# Altium schematic sheet PassiveFilter.SchDoc
size A
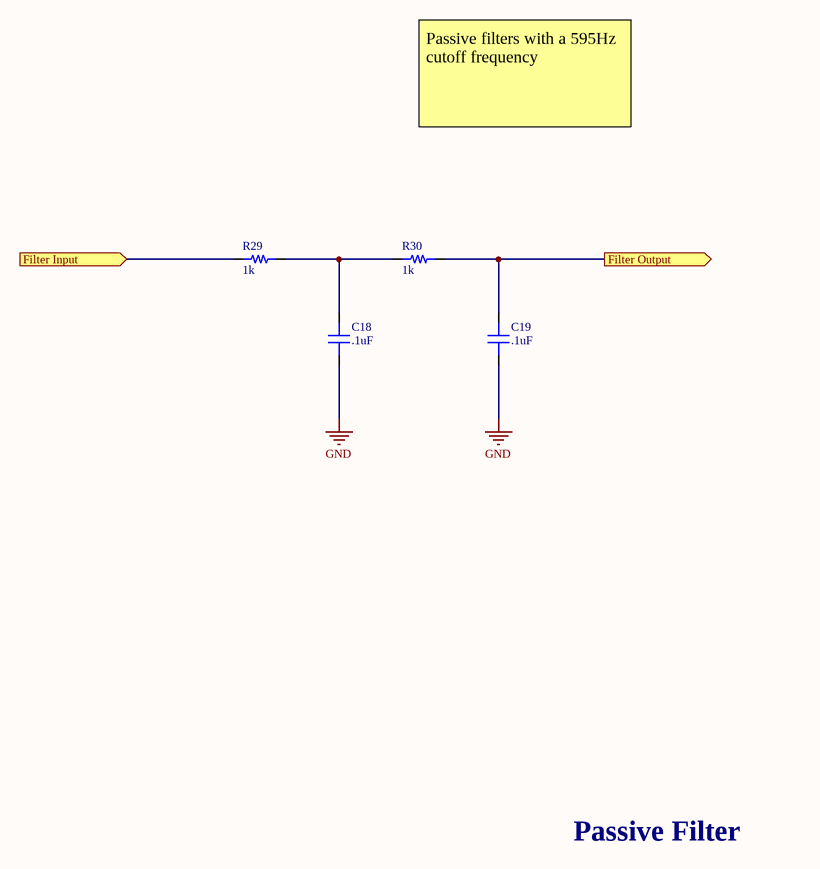
[diagram p0: PassiveFilter.SchDoc]

## Parts
C18  capacitance: .1uF  [0603]  (hidden comment: capacitor)
C19  capacitance: .1uF  [0603]  (hidden comment: capacitor)
R29  1k  [RES 0603/1608]
R30  1k  [RES 0603/1608]

## Ports
Filter Input (in), Filter Output (out)

## Nets
GND: C18.1 C19.1
Filter Input: R29.1 ; port Filter Input
Filter Output: C19.2 R30.2 ; port Filter Output
NetC18_2: C18.2 R29.2 R30.1

## Notes on the sheet
- Passive filters with a 595Hz cutoff frequency
- Passive Filter

## Library data of the parts
C18 C19 = 1: Generic 0603 capacitor; id: 1; voltage: 50; dielectric: Ceramic; percent tolerance: 10; name: 0603 Capacitor; ESR: 1; package: 0603; quantity: 0
R29 R30 = 1: id: 1; name: 0603 Resistor; percent tolerance: 5; resistance: 1k; package: 0603; quantity: 0